# Altium schematic sheet diplexer.SchDoc
size Legal; CompanyName: Brinton Engineering, LLC; Address1: 3479 Edison Way; Address2: Menlo Park CA 94025; Address3: +1 (877) 778-8435; Address4: brintonengineering.com; DocumentNumber: 46; Revision: 1; SheetNumber: 46; SheetTotal: 50
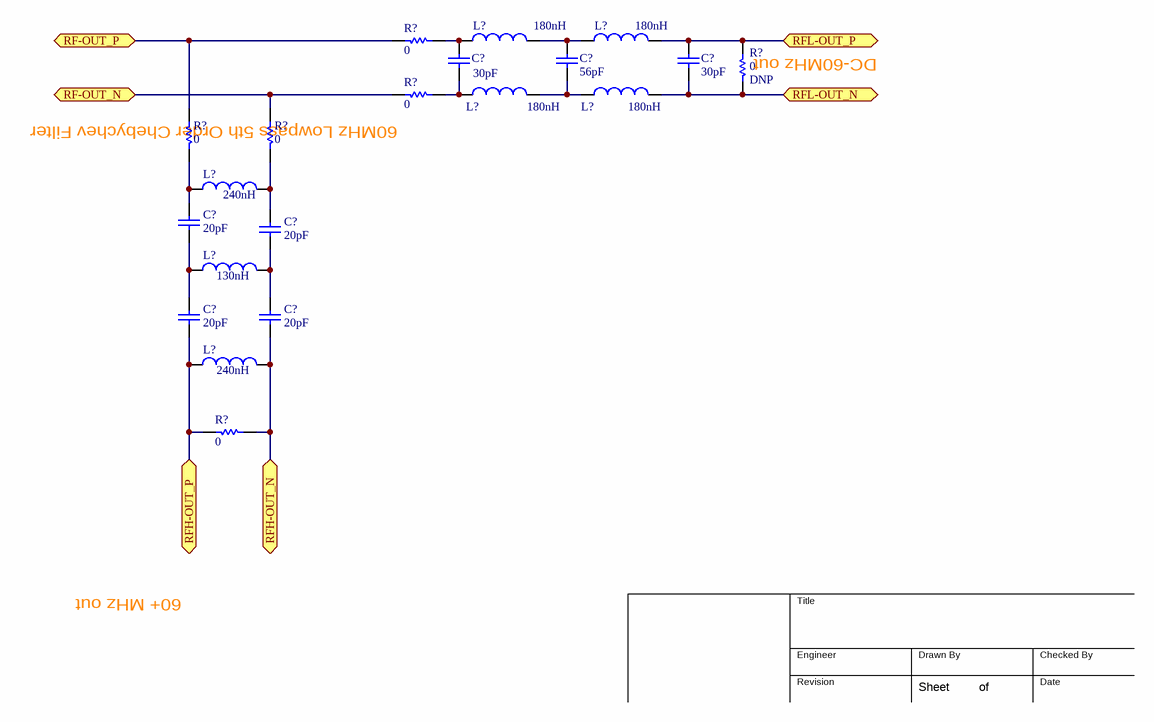
[diagram p0: diplexer.SchDoc]

## Parts
(Parts that share a designator on the sheet are numbered #1, #2 ... from top to bottom, then left to right.)
C?#1  value 30pF  [0402]  (hidden comment: CAP 0402)
C?#2  value 56pF  [0402]  (hidden comment: CAP 0402)
C?#3  value 30pF  [0402]  (hidden comment: CAP 0402)
C?#4  value 20pF  [0402]  (hidden comment: CAP 0402)
C?#5  value 20pF  [0402]  (hidden comment: CAP 0402)
C?#6  value 20pF  [0402]  (hidden comment: CAP 0402)
C?#7  value 20pF  [0402]  (hidden comment: CAP 0402)
L?#1  value 180nH  [0402]  (hidden comment: IND 0402)
L?#2  value 180nH  [0402]  (hidden comment: IND 0402)
L?#3  value 180nH  [0402]  (hidden comment: IND 0402)
L?#4  value 180nH  [0402]  (hidden comment: IND 0402)
L?#5  value 240nH  [0402]  (hidden comment: IND 0402)
L?#6  value 130nH  [0402]  (hidden comment: IND 0402)
L?#7  value 240nH  [0402]  (hidden comment: IND 0402)
R?#1  value 0  [0402]  (hidden comment: RES 0402)
R?#2  value 0  [0402]  (hidden comment: RES 0402)
R?#3  value 0  Do Not Place: DNP  [0402]  (hidden comment: RES 0402)
R?#4  value 0  [0402]  (hidden comment: RES 0402)
R?#5  value 0  [0402]  (hidden comment: RES 0402)
R?#6  value 0  [0402]  (hidden comment: RES 0402)

## Ports
RF-OUT_N, RF-OUT_P, RFH-OUT_N, RFH-OUT_P, RFL-OUT_N, RFL-OUT_P

## Nets
RF-OUT_N: R?#2.2 R?#5.1 ; port RF-OUT_N
RF-OUT_P: R?#1.2 R?#4.1 ; port RF-OUT_P
RFH-OUT_N: C?#7.1 L?#7.1 R?#6.1 ; port RFH-OUT_N
RFH-OUT_P: C?#6.1 L?#7.2 R?#6.2 ; port RFH-OUT_P
RFL-OUT_N: C?#3.1 L?#4.1 R?#3.1 ; port RFL-OUT_N
RFL-OUT_P: C?#3.2 L?#2.1 R?#3.2 ; port RFL-OUT_P
NetC?#1_1: C?#1.1 L?#3.2 R?#2.1
NetC?#1_2: C?#1.2 L?#1.2 R?#1.1
NetC?#2_1: C?#2.1 L?#3.1 L?#4.2
NetC?#2_2: C?#2.2 L?#1.1 L?#2.2
NetC?#4_1: C?#4.1 C?#6.2 L?#6.2
NetC?#4_2: C?#4.2 L?#5.2 R?#4.2
NetC?#5_1: C?#5.1 C?#7.2 L?#6.1
NetC?#5_2: C?#5.2 L?#5.1 R?#5.2

## Notes on the sheet
- DC-60MHz out
- 60MHz Lowpass 5th Order Chebychev Filter
- 60+ MHz out
- Title
- Engineer
- Revision
- Drawn By
- Checked By
- Date
- Sheet
- of

## Library data of the parts
C?#1 C?#3 = CAP 0402: Manufacturer: Johanson Technology; Manufacturer P/N: 500R07S300JV4T; Voltage: 50V; PCB Package: 0402
C?#2 = CAP 0402: Manufacturer: Vishay Vitramon; Manufacturer P/N: VJ0402D560JXAAJ; Voltage: 50V; PCB Package: 0402
C?#4-C?#7 = CAP 0402: Manufacturer: Kemet; Manufacturer P/N: CBR04C200F5GAC; Voltage: 50V; PCB Package: 0402
L?#1-L?#4 = INDUCTOR: Inductor Wirewound Air 91nH +/-2% SMD 0402; Manufacturer P/N: LQG15HSR18J02D; Manufacturer: Murata
L?#5 L?#7 = INDUCTOR: Inductor Wirewound Air 91nH +/-2% SMD 0402; Manufacturer P/N: MLK1005SR24JTD25; Manufacturer: TDK
L?#6 = INDUCTOR: Inductor Wirewound Air 91nH +/-2% SMD 0402; Manufacturer P/N: MLK1005SR13JTD25; Manufacturer: TDK
R?#1-R?#6 = RES 0402: Resistor, SMD 0402; PCB Package: 0402; Manufacturer: *; Manufacturer P/N: *
  R?#1 R?#2 R?#4-R?#6: Do Not Place: *